# Altium schematic sheet Stacked_Pot_Breakout.SchDoc
size A4
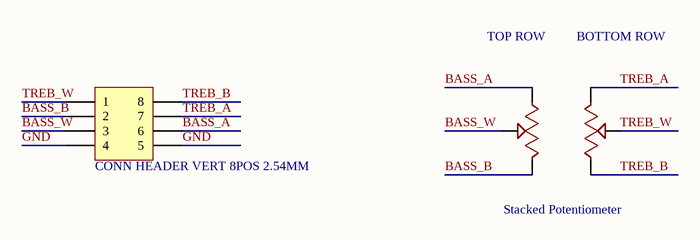
[diagram p0: Stacked_Pot_Breakout.SchDoc]

## Parts
J1  CONN HEADER VERT 8POS 2.54MM  [CONN HEADER VERT 8POS 2.54MM]
VR1  Stacked Potentiometer  [STACKED POTENTIOMETER]

## Nets
BASS_A: J1.6 VR1.1(A1)
BASS_B: J1.2 VR1.3(B1)
BASS_W: J1.3 VR1.2(W1)
GND: J1.4 J1.5
TREB_A: J1.7 VR1.6(A2)
TREB_B: J1.8 VR1.4(B2)
TREB_W: J1.1 VR1.5(W2)

## Notes on the sheet
- (in symbol Stacked Potentiometer) TOP ROW; BOTTOM ROW

## Library data of the parts
J1 = CONN HEADER VERT 8POS 2.54MM: Connector Header Through Hole 8 position 0.100" (2.54mm); Manufacturer: Samtec Inc.; Digikey Part Number: SAM8996-ND